# EAGLE design DAC_VGA_8b (EAGLE 7.3.0)
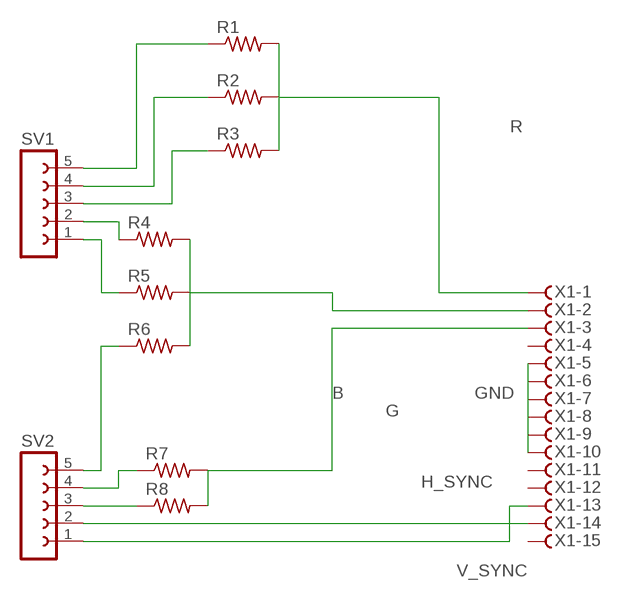
[diagram p0: schematic, sheet 1]

## Parts
R1  R-US_0204/5  [0204/5]
R2  R-US_0204/5  [0204/5]
R3  R-US_0204/5  [0204/5]
R4  R-US_0204/5  [0204/5]
R5  R-US_0204/5  [0204/5]
R6  R-US_0204/5  [0204/5]
R7  R-US_0204/5  [0204/5]
R8  R-US_0204/5  [0204/5]
SV1  FE05W  [FE05W]
SV2  FE05W  [FE05W]
X1  HF15VS  [HDF15V]

## Nets
B: R7.2 R8.2 X1.3
G: R4.2 R5.2 R6.2 X1.2
GND: X1.5 X1.6 X1.7 X1.8 X1.9 X1.10
H_SYNC: SV2.2 X1.14
N$1: R4.1 SV1.2
N$2: R5.1 SV1.1
N$3: R6.1 SV2.5
N$4: R7.1 SV2.4
N$5: R8.1 SV2.3
N$11: R3.1 SV1.3
N$12: R2.1 SV1.4
N$13: R1.1 SV1.5
R: R1.2 R2.2 R3.2 X1.1
V_SYNC: SV2.1 X1.13
Unconnected: X1.4 X1.11 X1.12 X1.15

## Library data of the parts
R1-R8 = rcl:R-US_: RESISTOR, American symbol
SV1 SV2 = con-lsta:FE05W: FEMALE HEADER; OC_FARNELL: unknown; OC_NEWARK: unknown
X1 = con-subd:HF15?S: SUB-D; OC_FARNELL: unknown; OC_NEWARK: unknown

## Board
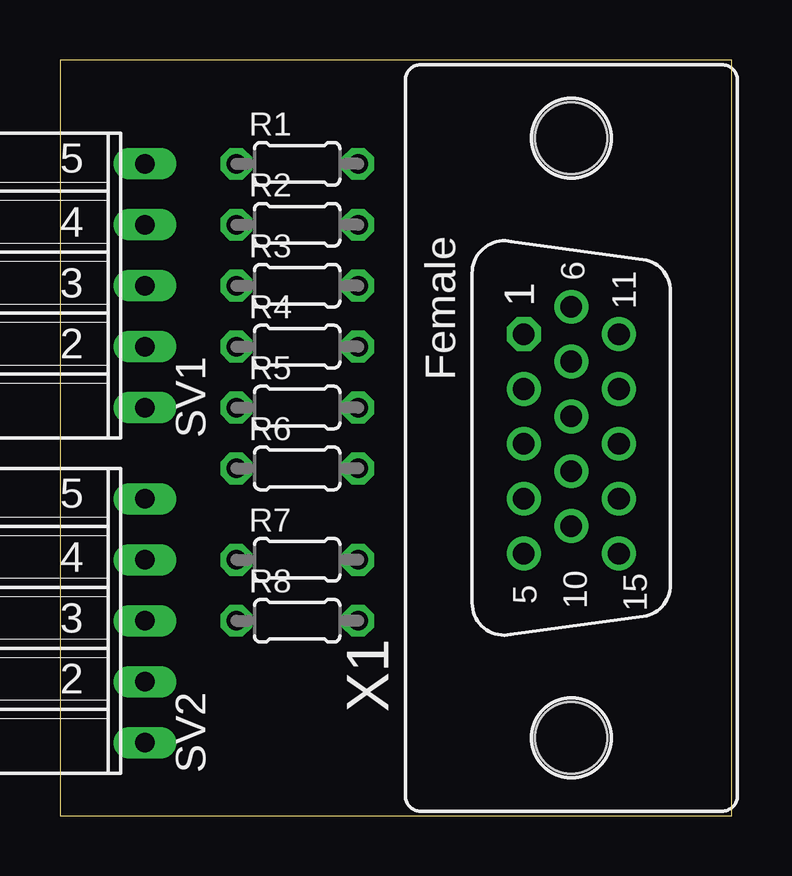
[diagram p1: board, top side]
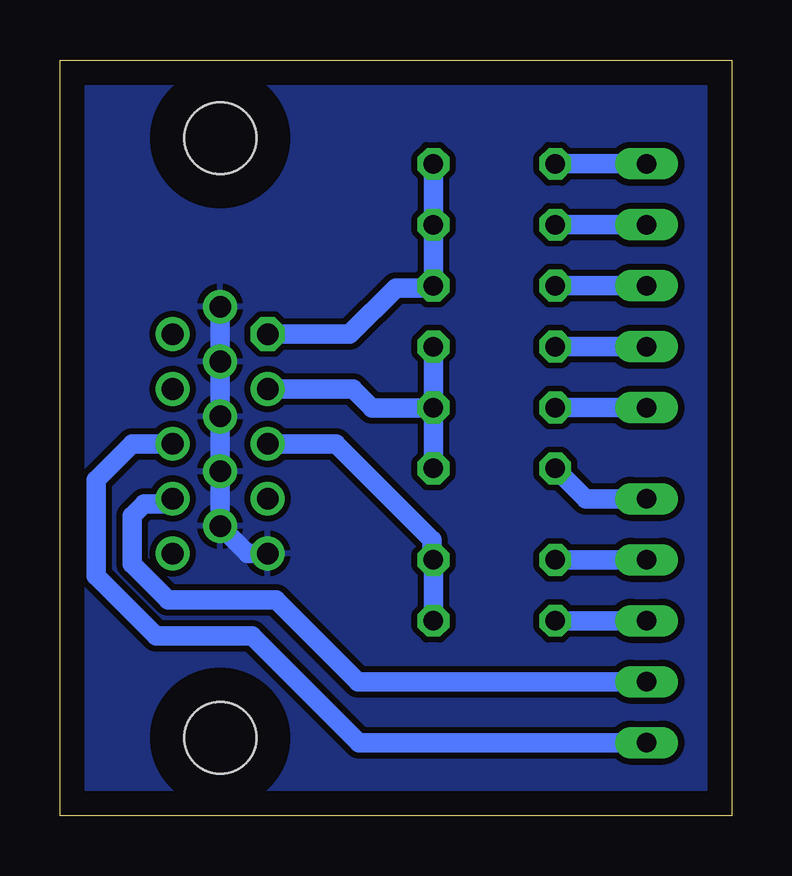
[diagram p2: board, bottom side, seen from below]

Size 28 x 31.5 mm. Coordinates in mm from the lower left corner, seen from the top.
Outline: 0,0 28,0 28,31.5 0,31.5 0,0
Copper layers (1*16): Top 0.035mm / dielectric 1.5mm / Bottom 0.035mm
Design rules "default": minimum track width 10mil, minimum drill 24mil, track to track 8mil, track to pad 8mil, pad to pad 8mil, via to via 8mil, smd to smd 8mil, copper to edge 40mil, drill to drill 8mil, minimum pad ring 10mil, minimum via ring 8mil, stop-mask expansion 4mil, vias tented up to drill 0mil, thermal gap 10mil

### Footprints (pad centres in the part's own frame; a part is rotated, then mirrored left to right if it is on the bottom)
0204/5 = drill 0.813 octagon: 1 -2.54,0; 2 2.54,0
FE05W = drill 0.813 long: 1 -5.08,0; 2 -2.54,0; 3 0,0; 4 2.54,0; 5 5.08,0
HDF15V = drill 0.9 octagon: 1 4.329,1.98 | drill 0.9: 2 2.043,1.98; 3 -0.243,1.98; 4 -2.529,1.98; 5 -4.815,1.98; 6 5.472,0; 7 3.186,0; 8 0.9,0; 9 -1.386,0; 10 -3.672,0; 11 4.329,-1.98; 12 2.043,-1.98; 13 -0.243,-1.98; 14 -2.529,-1.98; 15 -4.815,-1.98 | hole 3: -12.5,0; 12.5,0

### Placement (x,y rotation side)
R1  9.89,27.17 0 top
R2  9.89,24.63 0 top
R3  9.89,22.09 0 top
R4  9.89,19.55 0 top
R5  9.89,17.01 0 top
R6  9.89,14.47 0 top
R7  9.89,10.66 0 top
R8  9.89,8.12 0 top
SV1  3.54,22.09 90 top
SV2  3.54,8.12 90 top
X1  21.32,15.74 90 top

### Tracks (layer width: path | path; a pad name or v marks a point on that pad's centre or on a via)
B
  Bottom 0.813: X1.3 16.5,15.5 12.5,11.5 12.5,10.73 R7.2 R8.2
G
  Bottom 0.813: R4.2 R5.2 | R5.2 R6.2 | X1.2 15.78,17.78 15,17 R5.2
GND
  Bottom 0.813: X1.5 20.18,10.93 X1.10 X1.9 X1.8 X1.7 X1.6
  pour Bottom (isolate 0.254): 0,31.5 28,31.5 28,0 0,0
H_SYNC
  Bottom 0.813: SV2.2 15.58,5.58 19,9 23.5,9 25,10.5 25,12.5 24.5,13 23.51,13 X1.14
N$1
  Bottom 0.813: SV1.2 R4.1
N$2
  Bottom 0.813: SV1.1 R5.1
N$3
  Bottom 0.813: SV2.5 6.08,13.2 R6.1
N$4
  Bottom 0.813: SV2.4 R7.1
N$5
  Bottom 0.813: SV2.3 R8.1
N$11
  Bottom 0.813: SV1.3 R3.1
N$12
  Bottom 0.813: SV1.4 R2.1
N$13
  Bottom 0.813: SV1.5 R1.1
R
  Bottom 0.813: R1.2 R2.2 R3.2 12.52,22 14,22 15.93,20.07 X1.1
V_SYNC
  Bottom 0.813: SV2.1 15.54,3.04 20,7.5 24,7.5 26.5,10 26.5,14 25,15.5 X1.13